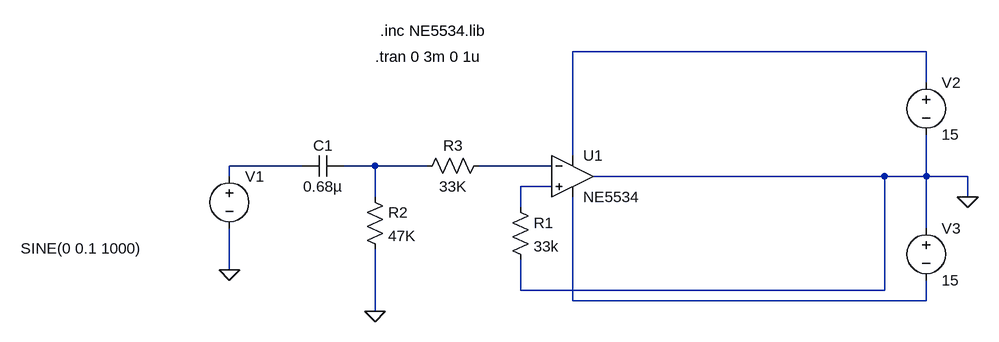
[diagram p0: schematic test.asc]
test.asc, the LTspice schematic file:
Version 4.1
SHEET 1 880 680
WIRE 688 0 144 0
WIRE 688 48 688 0
WIRE 144 160 144 0
WIRE -272 176 -384 176
WIRE -160 176 -208 176
WIRE -80 176 -160 176
WIRE 112 176 0 176
WIRE -384 192 -384 176
WIRE 624 192 176 192
WIRE 688 192 688 128
WIRE 688 192 624 192
WIRE 752 192 688 192
WIRE 112 208 64 208
WIRE -160 224 -160 176
WIRE 752 224 752 192
WIRE 64 240 64 208
WIRE 688 272 688 192
WIRE -384 336 -384 272
WIRE 64 368 64 320
WIRE 624 368 624 192
WIRE 624 368 64 368
WIRE 144 384 144 224
WIRE 688 384 688 352
WIRE 688 384 144 384
WIRE -160 400 -160 304
FLAG 752 224 0
FLAG -384 336 0
FLAG -160 400 0
SYMBOL OpAmps\\opamp2 144 128 R0
SYMATTR InstName U1
SYMATTR Value NE5534
SYMBOL voltage -384 176 R0
WINDOW 123 0 0 Left 0
WINDOW 39 0 0 Left 0
WINDOW 3 -321 127 Left 2
SYMATTR InstName V1
SYMATTR Value SINE(0 0.1 1000)
SYMBOL voltage 688 32 R0
SYMATTR InstName V2
SYMATTR Value 15
SYMBOL voltage 688 256 R0
SYMATTR InstName V3
SYMATTR Value 15
SYMBOL res 48 224 R0
SYMATTR InstName R1
SYMATTR Value 33k
SYMBOL res -176 208 R0
SYMATTR InstName R2
SYMATTR Value 47K
SYMBOL res 16 160 R90
WINDOW 0 0 56 VBottom 2
WINDOW 3 32 56 VTop 2
SYMATTR InstName R3
SYMATTR Value 33K
SYMBOL cap -208 160 R90
WINDOW 0 0 32 VBottom 2
WINDOW 3 32 32 VTop 2
SYMATTR InstName C1
SYMATTR Value 0.68µ
TEXT -160 8 Left 2 !.tran 0 3m 0 1u
TEXT -152 -32 Left 2 !.inc NE5534.lib

The netlist it stands for:
* test.asc
X§U1 N005 N004 N001 N006 0 NE5534  ; pins In+ In- V+ V- OUT
V1 N002 0 SINE(0 0.1 1000)
V2 N001 0 15
V3 0 N006 15
R1 N005 0 33k
R2 N003 0 47K
R3 N004 N003 33K
C1 N003 N002 0.68µ
.tran 0 3m 0 1u
.inc NE5534.lib
.backanno
.end